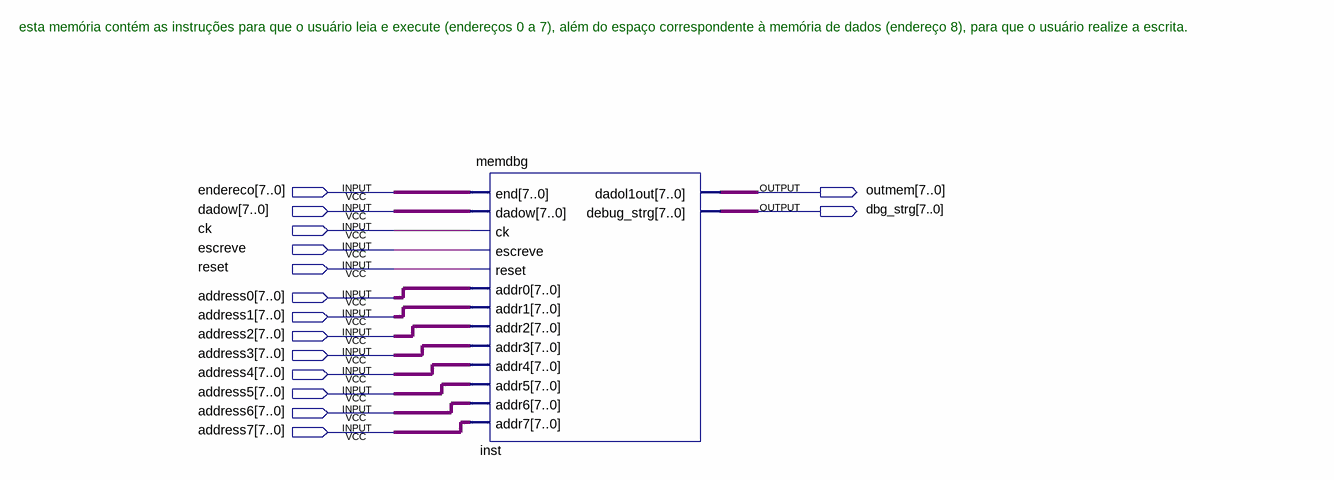
[diagram p0: schematic sheet]
// Quartus schematic regmem_dbg.bdf as structural Verilog: 1 symbols, 15 pins
module regmem_dbg (
  input  [7:0] endereco,
  input  [7:0] dadow,
  input  ck,
  input  escreve,
  input  reset,
  input  [7:0] address0,
  input  [7:0] address1,
  input  [7:0] address2,
  input  [7:0] address3,
  input  [7:0] address4,
  input  [7:0] address5,
  input  [7:0] address6,
  input  [7:0] address7,
  output [7:0] outmem,
  output [7:0] dbg_strg
);

  memdbg inst (
    .\end (endereco), .dadow(dadow), .ck(ck), .escreve(escreve), .reset(reset), .addr0(address0),
    .addr1(address1), .addr2(address2), .addr3(address3), .addr4(address4), .addr5(address5),
    .addr6(address6), .addr7(address7), .dadol1out(outmem), .debug_strg(dbg_strg));

  // Notes on the sheet:
  //   esta memória contém as instruções para que o usuário leia e execute (endereços 0 a 7), além do espaço correspondente à memória de dados (endereço 8), para que o usuário realize a escrita. 
endmodule
